# Altium schematic sheet Digital_Input.SchDoc: Digital Inputs
size 297 x 209 mm; Author: G.Kasprowicz; DrawnBy: G.Kasprowicz; Organization: Altium Limited; Address1: L3, 12a Rodborough Rd; Address2: Frenchs Forest; Address3: NSW; Address4: Australia 2086; DocumentNumber: 14; SheetNumber: 14; SheetTotal: 36; Title2: Digital Inputs
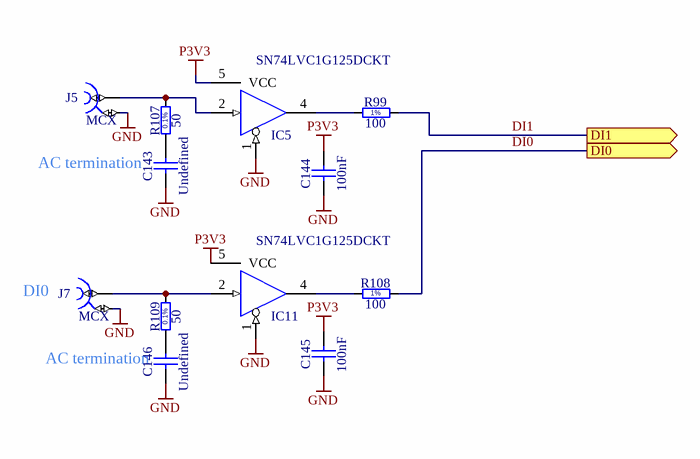
[diagram p0: Digital_Input.SchDoc]

## Parts
C143  Undefined  [CAPC1608X90N]
C144  100nF  [CAPC1005X55N]
C145  100nF  [CAPC1005X55N]
C146  Undefined  [CAPC1608X90N]
IC5  SN74LVC1G125DCKT  [SOT65P210X110-5N]
IC11  SN74LVC1G125DCKT  [SOT65P210X110-5N]
J5  MCX  [AMPHENOL_919-383J-51A]
J7  MCX  [AMPHENOL_919-383J-51A]
R99  100  [RESC1005X40N]
R107  50  [RESC1005X35N]
R108  100  [RESC1005X40N]
R109  50  [RESC1005X35N]

## Ports
DI0 (out), DI1 (out)

## Nets
GND: C143.1 C144.1 C145.1 C146.1 IC5.1(~{G}) IC5.3(GND) IC11.1(~{G}) IC11.3(GND) J5.2 J7.2
P3V3: C144.2 C145.2 IC5.5(VCC) IC11.5(VCC)
DI0: R108.2 ; port DI0
DI1: R99.2 ; port DI1
NetC143_2: C143.2 R107.1
NetC146_2: C146.2 R109.1
NetIC5_2: IC5.2(IN) J5.1 R107.2
NetIC5_4: IC5.4(OUT) R99.1
NetIC11_2: IC11.2(IN) J7.1 R109.2
NetIC11_4: IC11.4(OUT) R108.1

## Notes on the sheet
- AC termination
- (near J7) DI0
- (near C146) AC termination
- Project
- Document
- Designer
- Drawn by
- Check.by
- File
- Last Mod.
- Print Date
- Sheet
- Size
- A4
- of
- Rev
- (in symbol R0402_50R_0.1%_0.05W_25PPM) 0.1%
- (in symbol R0402_100R_1%_0.1W_100PPM) 1%

## Library data of the parts
C143 C146 = CC0603_NO-VALUE: Non-polarised capacitor; Part Description: Reserved Footprint For 0603(1608) Chip Ceramic Capacitor; Mounted: No; Part Number: CC0603_NO-VALUE; Component Kind: Standard; Component Type: Standard; Pin Count: 2; Value: Undefined; Status: None; Manufacturer: Undefined; Manufacturer Part Number: CC0603_NO-VALUE; Case: 0603; Socket: No; SMD: Yes; Sense: No; Manufacturer1 ComponentHeight: 0.9mm; HelpURL: Undefined; Author: CERN DEM MR; CreateDate: 22.11.2016; LatestRevisionDate: 22.11.2016
C144 C145 = CC0402_100NF_16V_10%_X7R: Non-polarised capacitor; Part Description: SMD Multilayer Chip Ceramic Capacitor; Manufacturer: GENERIC; Manufacturer1 Part Number: GRM155R71C104KA88D; Voltage: 16V; TC: X7R; Tolerance: ±10%; Part Number: CC0402_100NF_16V_10%_X7R; Component Kind: Standard; Component Type: Standard; Pin Count: 2; Value: 100nF; Status: Not Recommended; Manufacturer Part Number: CC0402_100NF_16V_10%_X7R; Case: 0402; Mounted: Yes; Socket: No; SMD: Yes; Sense: No; Manufacturer1 Example: MURATA; Manufacturer1 ComponentHeight: 0.55mm; HelpURL: \\cern.ch\dfs\Applications\Altium\Datasheets\CC0402_X7R_MURATA_GRM.pdf; Author: CERN DEM JLC; CreateDate: 05.12.2013; LatestRevisionDate: 03.12.2007
IC5 IC11 = SN74LVC1G125DCKT: Single Bus Buffer Gate With 3-State Output; Part Description: Single Bus Buffer Gate With 3-State Outputs; Manufacturer: TEXAS INSTRUMENTS; PressFit: No; Bonding: No; Part Number: SN74LVC1G125DCKT; Component Kind: Standard; Component Type: Standard; Device: SN74LVC1G125DCKT; PackageDescription: SOT353, SC70-5, SOT, 0.65mm Pitch, 5 pin, 1.25mm W X 2.00mm L X 1.10mm H, IPC Medium Density; Manufacturer Part Number: SN74LVC1G125DCKT; Pin Count: 5; Case: SOT353; Mounted: Yes; Socket: No; SMD: Yes; Sense: No; ComponentHeight: 1.1mm; Author: CERN DEM JLC; HelpURL: \\cern.ch\dfs\Applications\Altium\Datasheets\SN74LVC1G125DCKT.pdf; CreateDate: 19.12.2011; LatestRevisionDate: 19.12.2011
J5 J7 = AMPHENOL_919-383J-51A: Part Description: 50 Ohm, RF Connector, MCX Right Angle PCB Receptacle Jack; PressFit: No; Part Number: AMPHENOL_919-383J-51A; Component Kind: Standard; Component Type: Standard; Pin Count: 5; Family: MCX; Mounted: Yes; Socket: No; SMD: No; Sense: No; Status: None; Manufacturer: AMPHENOL; Manufacturer Part Number: 919-383J-51A; ComponentHeight: 6mm; HelpURL: \\cern.ch\dfs\Applications\Altium\Datasheets\AMPHENOL_919-383J-51A.pdf; Author: CERN DEM BC; CreateDate: 31.01.2019; LatestRevisionDate: 31.01.2019
R99 R108 = R0402_100R_1%_0.1W_100PPM: Resistor - 1%; Part Description: General Purpose Thick Film Chip Resistor; Manufacturer: GENERIC; Manufacturer Part Number: R0402_100R_1%_0.1W_100PPM_50V; Manufacturer1 Part Number: ERJ2RKF1000X; Power: 0.1W; TC: ±100ppm/°C; Voltage: 50V; PressFit: No; Part Number: R0402_100R_1%_0.1W_100PPM; Component Kind: Standard; Component Type: Standard; Pin Count: 2; Value: 100; Status: Not Recommended; Tolerance: ±1%; Case: 0402; Mounted: Yes; Sense: No; Socket: No; SMD: Yes; Manufacturer1 Example: PANASONIC; Manufacturer1 ComponentHeight: 0.4mm; HelpURL: \\cern.ch\dfs\Applications\Altium\Datasheets\R0402_PANASONIC_ERJ2RK.pdf; Author: CERN DEM JLC; CreateDate: 12/12/2013; LatestRevisionDate: 03/03/2015
R107 R109 = R0402_50R_0.1%_0.05W_25PPM: Resistor - 0.1%; Part Description: Thin Film Precision Resistor; Manufacturer: GENERIC; Manufacturer1 Part Number: FC0402E50R0BTBS; Power: 0.05W; TC: ±25ppm/°C; PressFit: No; Part Number: R0402_50R_0.1%_0.05W_25PPM; Component Kind: Standard; Component Type: Standard; Pin Count: 2; Value: 50; Status: Not Recommended; Tolerance: ±0.1%; Manufacturer Part Number: R0402_50R_0.1%_0.05W_25PPM; Case: 0402; Mounted: Yes; Sense: No; Socket: No; SMD: Yes; Manufacturer1 Example: VISHAY DALE; Manufacturer1 ComponentHeight: 0.38mm; HelpURL: \\cern.ch\dfs\Applications\Altium\Datasheets\R0402_VISHAY_FC.pdf; Author: CERN DEM JMW; CreateDate: 11/08/2016; LatestRevisionDate: 11/08/2016